# Altium schematic sheet Led.SchDoc
size A4; Author: Thomas Kreppel; CompanyName: Universidad de Santiago de Chile; Address1: Avenida Ecuador Nº 3519; Address2: Estación Central, Santiago; Address3: Chile; DocumentNumber: 10; SheetNumber: 10; SheetTotal: 10
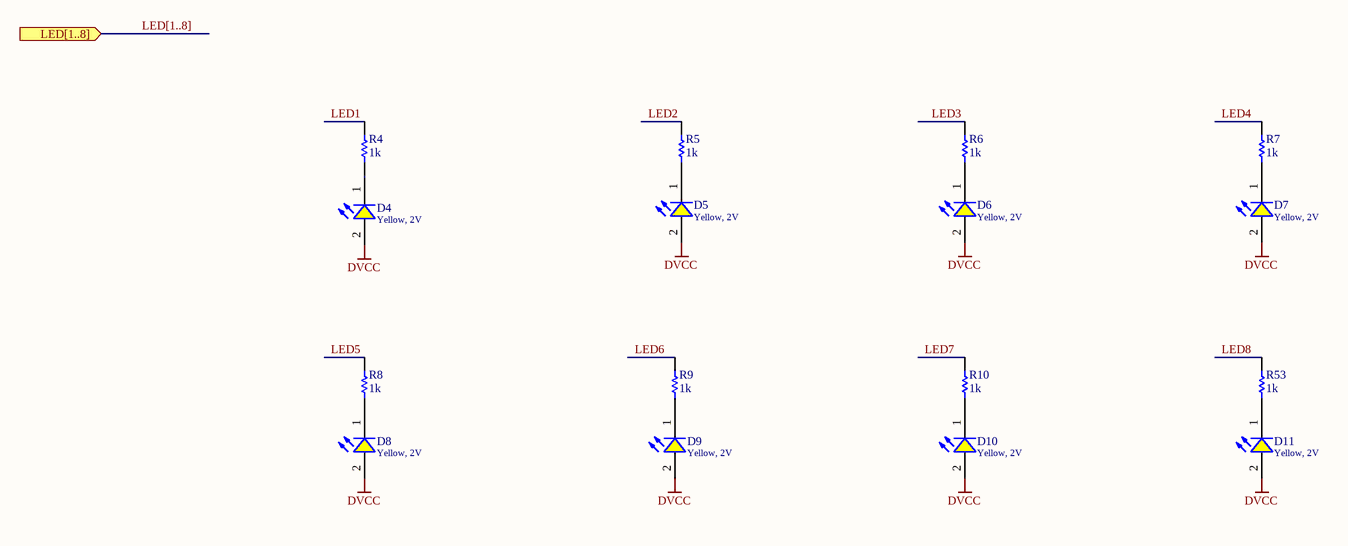
[diagram p0: Led.SchDoc]

## Parts
D4  Yellow, 2V  [WL-SMCW_0603_H=0.7mm]
D5  Yellow, 2V  [WL-SMCW_0603_H=0.7mm]
D6  Yellow, 2V  [WL-SMCW_0603_H=0.7mm]
D7  Yellow, 2V  [WL-SMCW_0603_H=0.7mm]
D8  Yellow, 2V  [WL-SMCW_0603_H=0.7mm]
D9  Yellow, 2V  [WL-SMCW_0603_H=0.7mm]
D10  Yellow, 2V  [WL-SMCW_0603_H=0.7mm]
D11  Yellow, 2V  [WL-SMCW_0603_H=0.7mm]
R4  1k  [RES_0603]
R5  1k  [RES_0603]
R6  1k  [RES_0603]
R7  1k  [RES_0603]
R8  1k  [RES_0603]
R9  1k  [RES_0603]
R10  1k  [RES_0603]
R53  1k  [RES_0603]

## Ports
LED[1..8] (in)

## Nets
DVCC: D4.2(A) D5.2(A) D6.2(A) D7.2(A) D8.2(A) D9.2(A) D10.2(A) D11.2(A)
LED1: R4.2
LED2: R5.2
LED3: R6.2
LED4: R7.2
LED5: R8.2
LED6: R9.2
LED7: R10.2
LED8: R53.2
NetD4_1: D4.1(K) R4.1
NetD5_1: D5.1(K) R5.1
NetD6_1: D6.1(K) R6.1
NetD7_1: D7.1(K) R7.1
NetD8_1: D8.1(K) R8.1
NetD9_1: D9.1(K) R9.1
NetD10_1: D10.1(K) R10.1
NetD11_1: D11.1(K) R53.1

## Buses and harness runs
bus LED[1..8] = port LED[1..8]

## Notes on the sheet
- Title
- Size:
- Date:
- A4
- Revision:
- Time:
- Sheet
- of
- Author:
- Project:

## Library data of the parts
D4-D11 = 150060YS75000: WL-SMCW SMT Mono-color Chip LED Waterclear, size 0603, Yellow, 2V, 140deg; Chip Technology: AlInGaP; Dominant Wavelength typ.: 590nm; Luminous Intensity typ.: 120mcd; Peak Wavelength typ.: 595nm; MF: Wurth Elektronik; Viewing Angle: 140deg; ComponentLink1Description: Manufacturer; ComponentLink1URL: http://www.we-online.de; ComponentLink2URL: https://www.we-online.com/catalog/datasheet/150060YS75000.pdf; ComponentLink2Description: Datasheet; Forward Voltage typ.: 2V; Emitting Color: Yellow; Mounting Technology: SMT; Operating Temperature: -40 to +85degC; Published Date: December 2019; MPN: 150060YS75000; Packaging: Tape and Reel; Package: 0603; Supplier 1: Digikey; Supplier Part Number 1: 732-4981-1-ND
R4-R10 R53 = Res0603: MPN: RC0603FR-071KL; Tolerance: 1%; Published: 8-Jun-2000; LatestRevisionDate: 17-Jul-2002; LatestRevisionNote: Re-released for DXP Platform.; PackageReference: AXIAL-0.3; Publisher: Altium Limited; PackageDescription: Axial Device, Thru-Hole; 2 Leads; 0.3 in Pin Spacing; Value: 1k; Supplier 1: Digikey; Supplier 2: Mouser; Supplier Part Number 1: 311-1.00KHRCT-ND; Package: 0603